# Altium schematic sheet ltk-mw-display_channel.SchDoc: SINGLE CHANNEL
size A3; Organization: Altium Limited; Address1: L3, 12a Rodborough Rd; Address2: Frenchs Forest; Address3: NSW; Address4: Australia 2086; DocumentNumber: 2; SheetNumber: 2; SheetTotal: 4
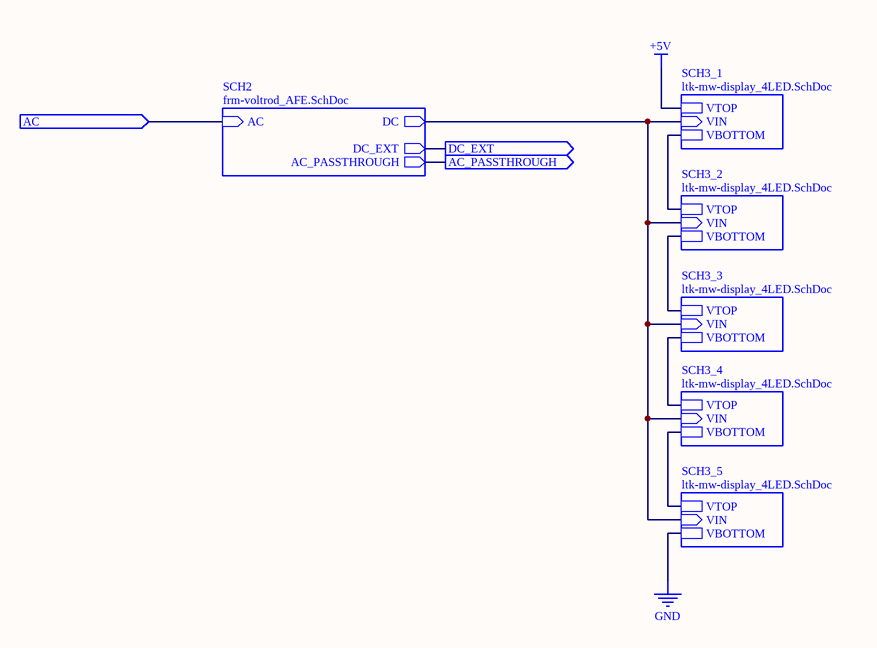
[diagram p0: ltk-mw-display_channel.SchDoc]

## Sub-sheets
SCH2 = frm-voltrod_AFE.SchDoc: DC (out), AC_PASSTHROUGH (out), DC_EXT (out), AC (in)
SCH3_1 = ltk-mw-display_4LED.SchDoc: VTOP, VBOTTOM, VIN (in)
SCH3_2 = ltk-mw-display_4LED.SchDoc: VTOP, VBOTTOM, VIN (in)
SCH3_3 = ltk-mw-display_4LED.SchDoc: VTOP, VBOTTOM, VIN (in)
SCH3_4 = ltk-mw-display_4LED.SchDoc: VTOP, VBOTTOM, VIN (in)
SCH3_5 = ltk-mw-display_4LED.SchDoc: VTOP, VBOTTOM, VIN (in)

## Ports
AC (in), AC_PASSTHROUGH (out), DC_EXT (out)

## Nets
+5V: sheet SCH3_1/VTOP
GND: sheet SCH3_5/VBOTTOM
AC: port AC, sheet SCH2/AC
AC_PASSTHROUGH: port AC_PASSTHROUGH, sheet SCH2/AC_PASSTHROUGH
DC_EXT: port DC_EXT, sheet SCH2/DC_EXT
(unnamed): sheet SCH3_1/VBOTTOM, sheet SCH3_2/VTOP
(unnamed): sheet SCH3_1/VIN, sheet SCH2/DC, sheet SCH3_2/VIN, sheet SCH3_3/VIN, sheet SCH3_4/VIN, sheet SCH3_5/VIN
(unnamed): sheet SCH3_2/VBOTTOM, sheet SCH3_3/VTOP
(unnamed): sheet SCH3_3/VBOTTOM, sheet SCH3_4/VTOP
(unnamed): sheet SCH3_4/VBOTTOM, sheet SCH3_5/VTOP

## Notes on the sheet
- Title
- Fermium LABS srl
- Size:
- Date:
- File:
- A4
- Prj
- Time:
- Sheet
- of
- Via Monselice 15a
- 35142 Padova PD
- Italy
- Git Hash: